# Altium project 28Pins_Project_V1I1.PrjPcb (part 4 of 5)
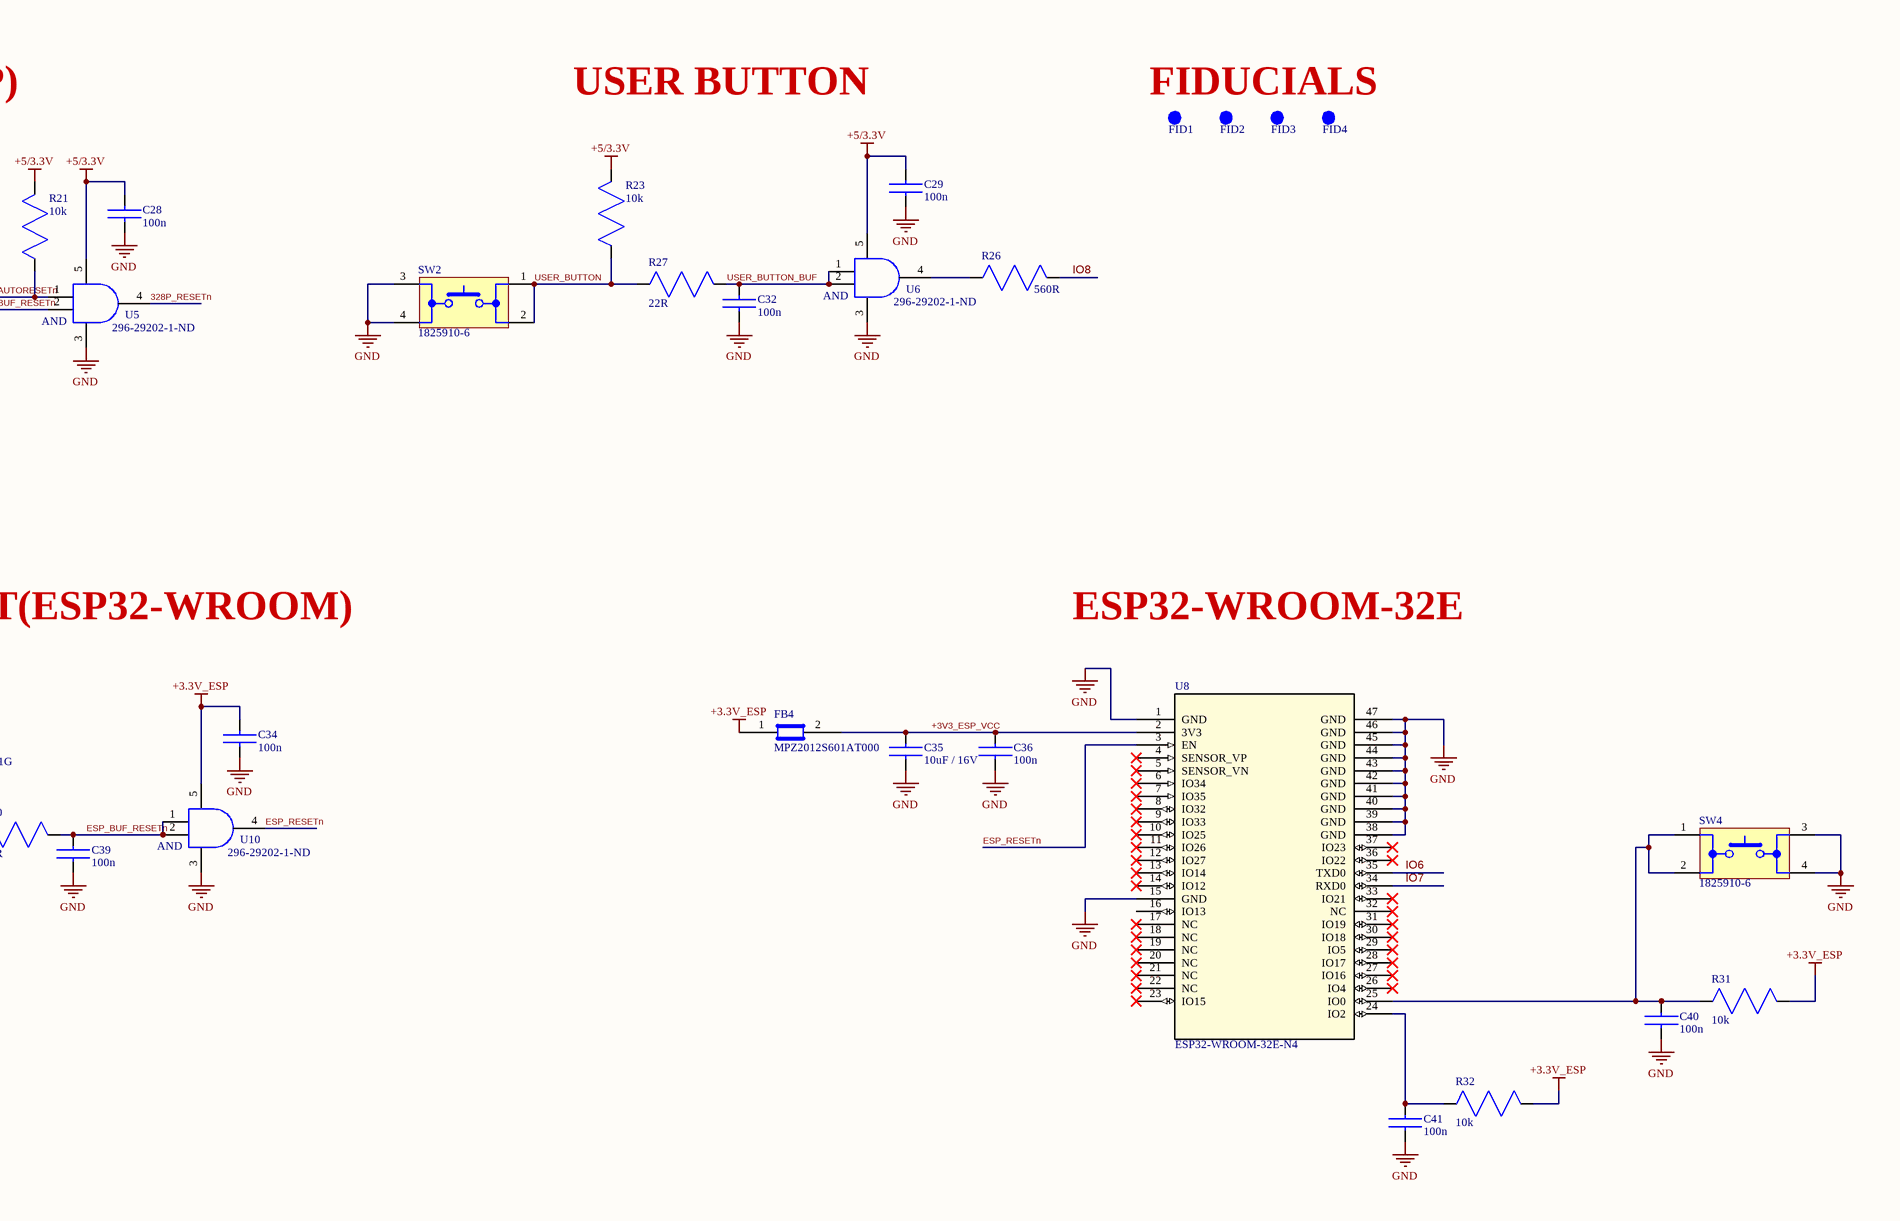
[diagram p6: 28Pins_Schematic.SchDoc, bottom right]

## Sheet 28Pins_Schematic.SchDoc (continued)

### Library data of the parts (continued)
R7 R19 R21-R24 R29 R31 R32 = RC0805FR-0710KL: Res Thick Film 0805 10K Ohm 1% 0.125W(1/8W) +/-100ppm/C Epoxy Pad SMD T/R; Manufacturer: Yageo Group; Max Power Dissipation: 125mW; Value: 10kΩ; Temperature Coefficient: 100ppm/°C; Voltage Rating: 150V; Supplier: DigiKey; Supplier Part Number: 311-10.0KCRCT-ND; Manufacturer Part Number: RC0805FR-0710KL; RoHS: Compliant; Category: Chip SMD Resistors; Pricing: 1=0.15, 10=0.016, 25=0.0136, 50=0.0112, 100=0.0071 (USD); Case/Package: 0805; Case Code (Imperial): 0805; China RoHS: Non-Compliant; Composition: Thick Film; Depth: 1.25mm; Features: Moisture Resistant; Height: 500µm; Lead Free: Lead Free; Length: 2mm; Lifecycle Status: Production; Max Operating Temperature: 155°C; Military Standard: Not; Min Operating Temperature: -55°C; Mounting Technology: Surface Mount; Pins: 2; Number of Terminals: 2; Number of Terminations: 2; Packaging: Tape and Reel; Power Dissipation: 125mW; Power Rating: 125mW; REACH SVHC: Yes; Schedule B: 8533210045, 8533210045|8533210045|8533210045|8533210045|8533210045|8533210045|8533210045|8533210045|8533210045|8533210045|8533210045|8533210045|8533210045|8533210045|8533210045|8533210045|8533210045|8533210045|8533210045|8533210045|8533210045|8533210045|8533210045|85; Termination: SMD/SMT; Tolerance: 1%; Voltage Rating (AC): 150V; Width: 1.25mm; Working Voltage: 150V; ComponentLink1URL: https://datasheet.octopart.com:443/RC0805FR-0710KL-Yageo-datasheet-175887523.pdf?src-supplier=IHS; ComponentLink1Description: https://datasheet.octopart.com:443/RC0805FR-0710KL-Yageo-datasheet-175887523.pdf?src-supplier=IHS; ComponentLink2URL: https://datasheet.octopart.com:443/RC0805FR-0710KL-Yageo-datasheet-62067350.pdf?src-supplier=Farnell; ComponentLink2Description: https://datasheet.octopart.com:443/RC0805FR-0710KL-Yageo-datasheet-62067350.pdf?src-supplier=Farnell; ComponentLink3URL: https://datasheet.octopart.com:443/RC0805FR-0710KL-Yageo-datasheet-13691069.pdf?src-supplier=Farnell; ComponentLink3Description: https://datasheet.octopart.com:443/RC0805FR-0710KL-Yageo-datasheet-13691069.pdf?src-supplier=Farnell; ComponentLink4URL: https://datasheet.octopart.com:443/RC0805FR-0710KL-Yageo-datasheet-103092701.pdf?src-supplier=Upverter; ComponentLink4Description: https://datasheet.octopart.com:443/RC0805FR-0710KL-Yageo-datasheet-103092701.pdf?src-supplier=Upverter; ComponentLink5URL: https://datasheet.octopart.com:443/RC0805FR-0710KL-Yageo-datasheet-98239111.pdf?src-supplier=Upverter; ComponentLink5Description: https://datasheet.octopart.com:443/RC0805FR-0710KL-Yageo-datasheet-98239111.pdf?src-supplier=Upverter; ComponentLink6URL: https://datasheet.octopart.com:443/RC0805FR-0710KL-Yageo---Phycomp-datasheet-67302840.pdf?src-supplier=Upverter; ComponentLink6Description: https://datasheet.octopart.com:443/RC0805FR-0710KL-Yageo---Phycomp-datasheet-67302840.pdf?src-supplier=Upverter; ComponentLink7URL: https://datasheet.octopart.com:443/RC0805FR-0710KL-Yageo-datasheet-8330313.pdf?src-supplier=element14+APAC; ComponentLink7Description: https://datasheet.octopart.com:443/RC0805FR-0710KL-Yageo-datasheet-8330313.pdf?src-supplier=element14+APAC; ComponentLink8URL: https://datasheet.octopart.com:443/RC0805FR-0710KL-Yageo-datasheet-12592811.pdf?src-supplier=element14+APAC; ComponentLink8Description: https://datasheet.octopart.com:443/RC0805FR-0710KL-Yageo-datasheet-12592811.pdf?src-supplier=element14+APAC; ComponentLink9URL: https://datasheet.octopart.com:443/RC0805FR-0710KL-Yageo-datasheet-164759695.pdf?src-supplier=Future+Electronics; ComponentLink9Description: https://datasheet.octopart.com:443/RC0805FR-0710KL-Yageo-datasheet-164759695.pdf?src-supplier=Future+Electronics; ComponentLink10URL: https://datasheet.octopart.com:443/RC0805FR-0710KL-Yageo-datasheet-15800360.pdf?src-supplier=Future+Electronics; ComponentLink10Description: https://datasheet.octopart.com:443/RC0805FR-0710KL-Yageo-datasheet-15800360.pdf?src-supplier=Future+Electronics; ComponentLink11URL: https://datasheet.octopart.com:443/RC0805FR-0710KL-Yageo-datasheet-8324252.pdf?src-supplier=Future+Electronics; ComponentLink11Description: https://datasheet.octopart.com:443/RC0805FR-0710KL-Yageo-datasheet-8324252.pdf?src-supplier=Future+Electronics; ComponentLink12URL: https://datasheet.octopart.com:443/RC0805FR-0710KL-Yageo-datasheet-79472498.pdf?src-supplier=Megastar; ComponentLink12Description: https://datasheet.octopart.com:443/RC0805FR-0710KL-Yageo-datasheet-79472498.pdf?src-supplier=Megastar; ComponentLink13URL: https://datasheet.octopart.com:443/RC0805FR-0710KL-Yageo-datasheet-27714392.pdf?src-supplier=Seeed+Studio; ComponentLink13Description: https://datasheet.octopart.com:443/RC0805FR-0710KL-Yageo-datasheet-27714392.pdf?src-supplier=Seeed+Studio; ComponentLink14URL: https://datasheet.octopart.com/RC0805FR-0710KL-Yageo-datasheet-73766026.pdf; ComponentLink14Description: https://datasheet.octopart.com/RC0805FR-0710KL-Yageo-datasheet-73766026.pdf; ComponentLink15URL: https://datasheet.octopart.com:443/RC0805FR-0710KL-Yageo-datasheet-118657.pdf?src-supplier=DigiKey; ComponentLink15Description: https://datasheet.octopart.com:443/RC0805FR-0710KL-Yageo-datasheet-118657.pdf?src-supplier=DigiKey; ComponentLink16URL: https://datasheet.octopart.com:443/RC0805FR-0710KL-Yageo-datasheet-502840.pdf?src-supplier=element14; ComponentLink16Description: https://datasheet.octopart.com:443/RC0805FR-0710KL-Yageo-datasheet-502840.pdf?src-supplier=element14; ComponentLink17URL: http://sigma.octopart.com:80/rohs_statement/Yageo-company-2.pdf?src-supplier=Compliance+Statements; ComponentLink17Description: http://sigma.octopart.com:80/rohs_statement/Yageo-company-2.pdf?src-supplier=Compliance+Statements; ComponentLink18URL: http://sigma.octopart.com:80/conflict_mineral_statement/Yageo-company-3.pdf?src-supplier=Compliance+Statements; ComponentLink18Description: http://sigma.octopart.com:80/conflict_mineral_statement/Yageo-company-3.pdf?src-supplier=Compliance+Statements
R8-R10 R18 R25 R27 R28 R30 = RC0805FR-072R2L: 125mW Thick Film Resistors 150V ±1% ±200ppm/℃ 2.2Ω 0805 Chip Resistor - Surface Mount ROHS; Manufacturer: Yageo Group; Temperature Coefficient: 200ppm/°C; Supplier: DigiKey; Supplier Part Number: 311-2.20CRCT-ND; Manufacturer Part Number: RC0805FR-072R2L; RoHS: Compliant; Category: Chip SMD Resistors; Stock: 48427; Pricing: 1=0.1, 10=0.022, 25=0.022, 50=0.0142 (USD); Case/Package: 0805; Case Code (Imperial): 0805; China RoHS: Non-Compliant; Composition: Thick Film; Depth: 1.25mm; Height: 500µm; Lead Free: Lead Free; Length: 2mm; Lifecycle Status: Production; Max Operating Temperature: 155°C; Military Standard: Not; Min Operating Temperature: -55°C; Mounting Technology: Surface Mount; Pins: 2; Number of Terminals: 2; Packaging: Cut Tape; Power Dissipation: 125mW; Power Rating: 125mW; REACH SVHC: Yes; Value: 2.2Ω; Schedule B: 8533210045, 8533210045|8533210045|8533210045|8533210045|8533210045|8533210045|8533210045|8533210045|8533210045|8533210045|8533210045|8533210045|8533210045|8533210045, 8533210045|8533210045|8533210045|8533210045|8533210045|8533210045|8533210045|8533210045|8533210045|8533210045|8533210045|8533210045|8533210045|8533210045|8533210045, 8533210045|8533210045|8533210045|8533210045|8533210045|8533210045|8533210045|8533210045|8533210045|8533210045|8533210045|8533210045|8533210045|8533210045|8533210045|8533210045; Termination: SMD/SMT; Tolerance: 1%; Voltage Rating: 150V; Voltage Rating (AC): 150V; Voltage Rating (DC): 150V; Width: 1.25mm; Working Voltage: 150V; ComponentLink1URL: https://datasheet.octopart.com:443/RC0805FR-072R2L-Yageo-datasheet-175887523.pdf?src-supplier=Newark; ComponentLink1Description: https://datasheet.octopart.com:443/RC0805FR-072R2L-Yageo-datasheet-175887523.pdf?src-supplier=Newark; ComponentLink2URL: https://datasheet.octopart.com:443/RC0805FR-072R2L-Yageo-datasheet-103092701.pdf?src-supplier=Upverter; ComponentLink2Description: https://datasheet.octopart.com:443/RC0805FR-072R2L-Yageo-datasheet-103092701.pdf?src-supplier=Upverter; ComponentLink3URL: https://datasheet.octopart.com:443/RC0805FR-072R2L-Yageo-datasheet-8330313.pdf?src-supplier=element14+APAC; ComponentLink3Description: https://datasheet.octopart.com:443/RC0805FR-072R2L-Yageo-datasheet-8330313.pdf?src-supplier=element14+APAC; ComponentLink4URL: https://datasheet.octopart.com:443/RC0805FR-072R2L-Yageo-datasheet-62067350.pdf?src-supplier=element14+APAC; ComponentLink4Description: https://datasheet.octopart.com:443/RC0805FR-072R2L-Yageo-datasheet-62067350.pdf?src-supplier=element14+APAC; ComponentLink5URL: https://datasheet.octopart.com:443/RC0805FR-072R2L-Yageo-datasheet-164759695.pdf?src-supplier=Future+Electronics; ComponentLink5Description: https://datasheet.octopart.com:443/RC0805FR-072R2L-Yageo-datasheet-164759695.pdf?src-supplier=Future+Electronics; ComponentLink6URL: https://datasheet.octopart.com:443/RC0805FR-072R2L-Yageo-datasheet-127823281.pdf?src-supplier=Future+Electronics; ComponentLink6Description: https://datasheet.octopart.com:443/RC0805FR-072R2L-Yageo-datasheet-127823281.pdf?src-supplier=Future+Electronics; ComponentLink7URL: https://datasheet.octopart.com:443/RC0805FR-072R2L-Yageo-datasheet-137700087.pdf?src-supplier=Future+Electronics; ComponentLink7Description: https://datasheet.octopart.com:443/RC0805FR-072R2L-Yageo-datasheet-137700087.pdf?src-supplier=Future+Electronics; ComponentLink8URL: https://datasheet.octopart.com:443/RC0805FR-072R2L-Yageo-datasheet-12592811.pdf?src-supplier=Future+Electronics; ComponentLink8Description: https://datasheet.octopart.com:443/RC0805FR-072R2L-Yageo-datasheet-12592811.pdf?src-supplier=Future+Electronics; ComponentLink9URL: https://datasheet.octopart.com:443/RC0805FR-072R2L-Yageo-datasheet-8324252.pdf?src-supplier=Future+Electronics; ComponentLink9Description: https://datasheet.octopart.com:443/RC0805FR-072R2L-Yageo-datasheet-8324252.pdf?src-supplier=Future+Electronics; ComponentLink10URL: https://datasheet.octopart.com:443/RC0805FR-072R2L-Yageo-datasheet-148775077.pdf?src-supplier=TME; ComponentLink10Description: https://datasheet.octopart.com:443/RC0805FR-072R2L-Yageo-datasheet-148775077.pdf?src-supplier=TME; ComponentLink11URL: https://datasheet.octopart.com/RC0805FR-072R2L-Yageo-datasheet-73766026.pdf; ComponentLink11Description: https://datasheet.octopart.com/RC0805FR-072R2L-Yageo-datasheet-73766026.pdf; ComponentLink12URL: https://datasheet.octopart.com:443/RC0805FR-072R2L-Yageo-datasheet-13691069.pdf?src-supplier=Farnell; ComponentLink12Description: https://datasheet.octopart.com:443/RC0805FR-072R2L-Yageo-datasheet-13691069.pdf?src-supplier=Farnell; ComponentLink13URL: https://datasheet.octopart.com:443/RC0805FR-072R2L-Yageo-datasheet-118657.pdf?src-supplier=DigiKey; ComponentLink13Description: https://datasheet.octopart.com:443/RC0805FR-072R2L-Yageo-datasheet-118657.pdf?src-supplier=DigiKey; ComponentLink14URL: http://sigma.octopart.com:80/rohs_statement/Yageo-company-2.pdf?src-supplier=Compliance+Statements; ComponentLink14Description: http://sigma.octopart.com:80/rohs_statement/Yageo-company-2.pdf?src-supplier=Compliance+Statements; ComponentLink15URL: http://sigma.octopart.com:80/conflict_mineral_statement/Yageo-company-3.pdf?src-supplier=Compliance+Statements; ComponentLink15Description: http://sigma.octopart.com:80/conflict_mineral_statement/Yageo-company-3.pdf?src-supplier=Compliance+Statements
R12 R14 R17 = RC0805FR-071KL: Resistor, thick film, SMD 0805 (2012), 1 kΩ, 0.125 W, ±1 %, RC0805FR-071KL; Manufacturer: Yageo Group; Max Power Dissipation: 125mW; Value: 1kΩ; Temperature Coefficient: 100ppm/°C; Tolerance: 1%; Voltage Rating: 150V; Supplier: DigiKey; Supplier Part Number: 311-1.00KCRDKR-ND; Manufacturer Part Number: RC0805FR-071KL; RoHS: Compliant; Category: Chip SMD Resistors; Pricing: 1=0.12, 10=0.013, 25=0.0124, 50=0.0072 (USD); Case/Package: 0805; Case Code (Imperial): 0805; China RoHS: Non-Compliant; Composition: Thick Film; Depth: 1.25mm; Features: Moisture Resistant; Height: 500µm; Lead Free: Lead Free; Length: 2mm; Lifecycle Status: Production; Max Operating Temperature: 155°C; Military Standard: Not; Min Operating Temperature: -55°C; Mounting Technology: Surface Mount; Pins: 2; Number of Terminals: 2; Number of Terminations: 2; Packaging: Tape & Reel; Power Dissipation: 125mW; Power Rating: 125mW; REACH SVHC: Yes; Schedule B: 8533210045, 8533210045|8533210045, 8533210045|8533210045|8533210045, 8533210045|8533210045|8533210045|8533210045; Termination: SMD/SMT; Voltage Rating (AC): 150V; Voltage Rating (DC): 150V; Width: 1.25mm; Working Voltage: 150V; ComponentLink1URL: https://datasheet.octopart.com:443/RC0805FR-071KL-Yageo-datasheet-175887523.pdf?src-supplier=IHS; ComponentLink1Description: https://datasheet.octopart.com:443/RC0805FR-071KL-Yageo-datasheet-175887523.pdf?src-supplier=IHS; ComponentLink2URL: https://datasheet.octopart.com:443/RC0805FR-071KL-Yageo-datasheet-103092701.pdf?src-supplier=Upverter; ComponentLink2Description: https://datasheet.octopart.com:443/RC0805FR-071KL-Yageo-datasheet-103092701.pdf?src-supplier=Upverter; ComponentLink3URL: https://datasheet.octopart.com:443/RC0805FR-071KL-Yageo-datasheet-8330313.pdf?src-supplier=element14+APAC; ComponentLink3Description: https://datasheet.octopart.com:443/RC0805FR-071KL-Yageo-datasheet-8330313.pdf?src-supplier=element14+APAC; ComponentLink4URL: https://datasheet.octopart.com:443/RC0805FR-071KL-Yageo-datasheet-62067350.pdf?src-supplier=element14+APAC; ComponentLink4Description: https://datasheet.octopart.com:443/RC0805FR-071KL-Yageo-datasheet-62067350.pdf?src-supplier=element14+APAC; ComponentLink5URL: https://datasheet.octopart.com:443/RC0805FR-071KL-Yageo-datasheet-12592811.pdf?src-supplier=element14+APAC; ComponentLink5Description: https://datasheet.octopart.com:443/RC0805FR-071KL-Yageo-datasheet-12592811.pdf?src-supplier=element14+APAC; ComponentLink6URL: https://datasheet.octopart.com:443/RC0805FR-071KL-Yageo-datasheet-164759695.pdf?src-supplier=Future+Electronics; ComponentLink6Description: https://datasheet.octopart.com:443/RC0805FR-071KL-Yageo-datasheet-164759695.pdf?src-supplier=Future+Electronics; ComponentLink7URL: https://datasheet.octopart.com:443/RC0805FR-071KL-Yageo-datasheet-8324252.pdf?src-supplier=Future+Electronics; ComponentLink7Description: https://datasheet.octopart.com:443/RC0805FR-071KL-Yageo-datasheet-8324252.pdf?src-supplier=Future+Electronics; ComponentLink8URL: https://datasheet.octopart.com:443/RC0805FR-071KL-Yageo-datasheet-79472498.pdf?src-supplier=Megastar; ComponentLink8Description: https://datasheet.octopart.com:443/RC0805FR-071KL-Yageo-datasheet-79472498.pdf?src-supplier=Megastar; ComponentLink9URL: https://datasheet.octopart.com/RC0805FR-071KL-Yageo-datasheet-73766026.pdf; ComponentLink9Description: https://datasheet.octopart.com/RC0805FR-071KL-Yageo-datasheet-73766026.pdf; ComponentLink10URL: https://datasheet.octopart.com:443/RC0805FR-071KL-Yageo-datasheet-13691069.pdf?src-supplier=Farnell; ComponentLink10Description: https://datasheet.octopart.com:443/RC0805FR-071KL-Yageo-datasheet-13691069.pdf?src-supplier=Farnell; ComponentLink11URL: https://datasheet.octopart.com:443/RC0805FR-071KL-Yageo-datasheet-118657.pdf?src-supplier=DigiKey; ComponentLink11Description: https://datasheet.octopart.com:443/RC0805FR-071KL-Yageo-datasheet-118657.pdf?src-supplier=DigiKey; ComponentLink12URL: https://datasheet.octopart.com:443/RC0805FR-071KL-Yageo-datasheet-502840.pdf?src-supplier=element14; ComponentLink12Description: https://datasheet.octopart.com:443/RC0805FR-071KL-Yageo-datasheet-502840.pdf?src-supplier=element14; ComponentLink13URL: http://sigma.octopart.com:80/rohs_statement/Yageo-company-2.pdf?src-supplier=Compliance+Statements; ComponentLink13Description: http://sigma.octopart.com:80/rohs_statement/Yageo-company-2.pdf?src-supplier=Compliance+Statements; ComponentLink14URL: http://sigma.octopart.com:80/conflict_mineral_statement/Yageo-company-3.pdf?src-supplier=Compliance+Statements; ComponentLink14Description: http://sigma.octopart.com:80/conflict_mineral_statement/Yageo-company-3.pdf?src-supplier=Compliance+Statements
R13 R20 = RC0805FR-071ML: 125mW Thick Film Resistors 150V ±100ppm/℃ ±1% 1MΩ 0805 Chip Resistor - Surface Mount ROHS; Manufacturer: Yageo Group; Temperature Coefficient: 100ppm/°C; Supplier: DigiKey; Supplier Part Number: 311-1.00MCRDKR-ND; Manufacturer Part Number: RC0805FR-071ML; RoHS: Compliant; Category: Chip SMD Resistors; Pricing: 1=0.1, 10=0.014, 25=0.0132, 50=0.0122, 100=0.0071 (USD); Case/Package: 0805; Case Code (Imperial): 0805; China RoHS: Non-Compliant; Composition: Thick Film; Depth: 1.25mm; Features: Moisture Resistant; Height: 500µm; Lead Free: Lead Free; Length: 2mm; Lifecycle Status: Production; Max Operating Temperature: 155°C; Max Power Dissipation: 125mW; Military Standard: Not; Min Operating Temperature: -55°C; Mounting Technology: Surface Mount; Pins: 2; Number of Terminals: 2; Number of Terminations: 2; Packaging: Tape & Reel; Power Dissipation: 125mW; Power Rating: 125mW; REACH SVHC: Yes; Value: 1MΩ; Schedule B: 8533210045, 8533210045|8533210045, 8533210045|8533210045|8533210045, 8533210045|8533210045|8533210045|8533210045; Termination: SMD/SMT; Tolerance: 1%; Voltage Rating: 150V; Voltage Rating (AC): 150V; Voltage Rating (DC): 150V; Width: 1.25mm; Working Voltage: 150V; ComponentLink1URL: https://datasheet.octopart.com:443/RC0805FR-071ML-Yageo-datasheet-175887523.pdf?src-supplier=IHS; ComponentLink1Description: https://datasheet.octopart.com:443/RC0805FR-071ML-Yageo-datasheet-175887523.pdf?src-supplier=IHS; ComponentLink2URL: https://datasheet.octopart.com:443/RC0805FR-071ML-Yageo-datasheet-103092701.pdf?src-supplier=Upverter; ComponentLink2Description: https://datasheet.octopart.com:443/RC0805FR-071ML-Yageo-datasheet-103092701.pdf?src-supplier=Upverter; ComponentLink3URL: https://datasheet.octopart.com:443/RC0805FR-071ML-Yageo-datasheet-79472498.pdf?src-supplier=Upverter; ComponentLink3Description: https://datasheet.octopart.com:443/RC0805FR-071ML-Yageo-datasheet-79472498.pdf?src-supplier=Upverter; ComponentLink4URL: https://datasheet.octopart.com:443/RC0805FR-071ML-Yageo-datasheet-8330313.pdf?src-supplier=element14+APAC; ComponentLink4Description: https://datasheet.octopart.com:443/RC0805FR-071ML-Yageo-datasheet-8330313.pdf?src-supplier=element14+APAC; ComponentLink5URL: https://datasheet.octopart.com:443/RC0805FR-071ML-Yageo-datasheet-62067350.pdf?src-supplier=Farnell; ComponentLink5Description: https://datasheet.octopart.com:443/RC0805FR-071ML-Yageo-datasheet-62067350.pdf?src-supplier=Farnell; ComponentLink6URL: https://datasheet.octopart.com:443/RC0805FR-071ML-Yageo-datasheet-13691069.pdf?src-supplier=Farnell; ComponentLink6Description: https://datasheet.octopart.com:443/RC0805FR-071ML-Yageo-datasheet-13691069.pdf?src-supplier=Farnell; ComponentLink7URL: https://datasheet.octopart.com:443/RC0805FR-071ML-Yageo-datasheet-164759695.pdf?src-supplier=Future+Electronics; ComponentLink7Description: https://datasheet.octopart.com:443/RC0805FR-071ML-Yageo-datasheet-164759695.pdf?src-supplier=Future+Electronics; ComponentLink8URL: https://datasheet.octopart.com:443/RC0805FR-071ML-Yageo-datasheet-127823281.pdf?src-supplier=Future+Electronics; ComponentLink8Description: https://datasheet.octopart.com:443/RC0805FR-071ML-Yageo-datasheet-127823281.pdf?src-supplier=Future+Electronics; ComponentLink9URL: https://datasheet.octopart.com:443/RC0805FR-071ML-Yageo-datasheet-137700087.pdf?src-supplier=Future+Electronics; ComponentLink9Description: https://datasheet.octopart.com:443/RC0805FR-071ML-Yageo-datasheet-137700087.pdf?src-supplier=Future+Electronics; ComponentLink10URL: https://datasheet.octopart.com:443/RC0805FR-071ML-Yageo-datasheet-12592811.pdf?src-supplier=Future+Electronics; ComponentLink10Description: https://datasheet.octopart.com:443/RC0805FR-071ML-Yageo-datasheet-12592811.pdf?src-supplier=Future+Electronics; ComponentLink11URL: https://datasheet.octopart.com:443/RC0805FR-071ML-Yageo-datasheet-8324252.pdf?src-supplier=Future+Electronics; ComponentLink11Description: https://datasheet.octopart.com:443/RC0805FR-071ML-Yageo-datasheet-8324252.pdf?src-supplier=Future+Electronics; ComponentLink12URL: https://datasheet.octopart.com/RC0805FR-071ML-Yageo-datasheet-73766026.pdf; ComponentLink12Description: https://datasheet.octopart.com/RC0805FR-071ML-Yageo-datasheet-73766026.pdf; ComponentLink13URL: https://datasheet.octopart.com:443/RC0805FR-071ML-Yageo-datasheet-118657.pdf?src-supplier=DigiKey; ComponentLink13Description: https://datasheet.octopart.com:443/RC0805FR-071ML-Yageo-datasheet-118657.pdf?src-supplier=DigiKey; ComponentLink14URL: https://datasheet.octopart.com:443/RC0805FR-071ML-Yageo-datasheet-502840.pdf?src-supplier=element14; ComponentLink14Description: https://datasheet.octopart.com:443/RC0805FR-071ML-Yageo-datasheet-502840.pdf?src-supplier=element14; ComponentLink15URL: http://sigma.octopart.com:80/rohs_statement/Yageo-company-2.pdf?src-supplier=Compliance+Statements; ComponentLink15Description: http://sigma.octopart.com:80/rohs_statement/Yageo-company-2.pdf?src-supplier=Compliance+Statements; ComponentLink16URL: http://sigma.octopart.com:80/conflict_mineral_statement/Yageo-company-3.pdf?src-supplier=Compliance+Statements; ComponentLink16Description: http://sigma.octopart.com:80/conflict_mineral_statement/Yageo-company-3.pdf?src-supplier=Compliance+Statements
SCKT_FOR_U1 = 4828-3004-CP: IC Socket, DIP28, 28 Contact(s), 2.54mm Term Pitch, 7.62mm Row Spacing, Solder; Manufacturer: 3M; Connector Type: DIP, Socket; Current Rating: 1A; Gender: Female; Insulation Resistance: 5GΩ; Number of Contacts: 28; Supplier: DigiKey; Supplier Part Number: 3M5480-ND; Manufacturer Part Number: 4828-3004-CP; RoHS: Compliant; Category: Connectors; Stock: 5452; Pricing: 1=0.96, 14=0.79786, 28=0.75929, 56=0.72304, 112=0.68848, 252=0.65016, 504=0.61911, 1008=0.58954, 2506=0.55285 (USD); China RoHS: Compliant; Contact Material: Bronze; Contact Plating: Tin; Depth: 5.08mm; Housing Material: Glass; Lead Free: Lead Free; Length: 35.43mm; Lifecycle Status: Production; Max Operating Temperature: 85°C; Min Operating Temperature: -25°C; Mounting Technology: Through Hole; Pins: 28; Number of Positions: 28; Number of Rows: 2; Orientation: Straight; Pitch: 2.54mm; REACH SVHC: Yes; Row Spacing: 7.62mm; Terminal Pitch: 2.54mm; Termination: Solder; Width: 10.16mm; ComponentLink1URL: https://datasheet.octopart.com:443/4828-3004-CP-3M-datasheet-11754339.pdf?src-supplier=element14+APAC; ComponentLink1Description: https://datasheet.octopart.com:443/4828-3004-CP-3M-datasheet-11754339.pdf?src-supplier=element14+APAC; ComponentLink2URL: https://datasheet.octopart.com:443/4828-3004-CP-3M-datasheet-125432.pdf?src-supplier=Verical; ComponentLink2Description: https://datasheet.octopart.com:443/4828-3004-CP-3M-datasheet-125432.pdf?src-supplier=Verical; ComponentLink3URL: https://datasheet.octopart.com:443/4828-3004-CP-3M-datasheet-110561487.pdf?src-supplier=RS+(Formerly+Allied+Electronics); ComponentLink3Description: https://datasheet.octopart.com:443/4828-3004-CP-3M-datasheet-110561487.pdf?src-supplier=RS+(Formerly+Allied+Electronics); ComponentLink4URL: https://datasheet.octopart.com:443/4828-3004-CP-3M-datasheet-12002015.pdf?src-supplier=RS+(Formerly+Allied+Electronics); ComponentLink4Description: https://datasheet.octopart.com:443/4828-3004-CP-3M-datasheet-12002015.pdf?src-supplier=RS+(Formerly+Allied+Electronics); ComponentLink5URL: http://sigma.octopart.com:80/conflict_mineral_statement/3M-company-24.pdf?src-supplier=Compliance+Statements; ComponentLink5Description: http://sigma.octopart.com:80/conflict_mineral_statement/3M-company-24.pdf?src-supplier=Compliance+Statements
SW1-SW4 = 1825910-6: Switch Tactile OFF (ON) SPST Round Button PC Pins 0.05A 24VDC 1.57N Thru-Hole Loose; Manufacturer: TE Connectivity; Manufacturer Lifecycle Status: ACTIVE; Actuator Length: 1.397mm; Actuator Material: PBT, Polyacetal, Resin; Contact Current Rating: 50mA; Contact Resistance: 100mΩ; Electrical Life: 100kcycles; Illumination Type: Illuminated, Non-Illuminated; Max Voltage Rating (DC): 24V; Number of Positions: 1; Operating Force: 1.568N; Switch Function: Off-Mom; Switch Travel: 250µm; Supplier: DigiKey; Supplier Part Number: 450-1650-ND; Manufacturer Part Number: 1825910-6; RoHS: Compliant; Category: Pushbutton Switches; Stock: 50938; Pricing: 1=0.13, 10=0.118, 25=0.1112, 100=0.1001, 250=0.093, 750=0.08485, 1500=0.08009, 3000=0.07565, 5250=0.07234 (USD); China RoHS: Compliant; Color: Black; Contact Material: Copper; Contact Plating: Silver; Current Rating: 50mA; ELV: Compliant; Height: 3.61mm; Housing Material: Nylon; Insulation Resistance: 100MΩ; Lead Free: Lead Free; Length: 5.99mm; Life (Cycles): 100kcycles; Lifecycle Status: Production; Material: Nylon; Max Current Rating: 50mA; Max Operating Temperature: 85°C; Mechanical Life: 100kcycles; Min Operating Temperature: -35°C; Mounting Technology: Through Hole; Orientation: Straight; Packaging: Bulk; REACH SVHC: Yes; Termination: PC Pin, PC Pins; Throw Configuration: SPST; Type: Switch; Voltage Rating (DC): 24V; Width: 6mm; ComponentLink1URL: https://datasheet.octopart.com:443/1825910-6-TE-Connectivity-datasheet-10294628.pdf?src-supplier=Newark; ComponentLink1Description: https://datasheet.octopart.com:443/1825910-6-TE-Connectivity-datasheet-10294628.pdf?src-supplier=Newark; ComponentLink2URL: https://datasheet.octopart.com:443/1825910-6-TE-Connectivity-datasheet-179971975.pdf?src-supplier=IHS; ComponentLink2Description: https://datasheet.octopart.com:443/1825910-6-TE-Connectivity-datasheet-179971975.pdf?src-supplier=IHS; ComponentLink3URL: https://datasheet.octopart.com:443/FSM4JH-TE-Connectivity---AMP-datasheet-512274.pdf?src-supplier=IHS; ComponentLink3Description: https://datasheet.octopart.com:443/FSM4JH-TE-Connectivity---AMP-datasheet-512274.pdf?src-supplier=IHS; ComponentLink4URL: https://datasheet.octopart.com:443/1825910-6-TE-Connectivity---Alcoswitch-datasheet-181441334.pdf?src-supplier=IHS; ComponentLink4Description: https://datasheet.octopart.com:443/1825910-6-TE-Connectivity---Alcoswitch-datasheet-181441334.pdf?src-supplier=IHS; ComponentLink5URL: https://datasheet.octopart.com:443/FSM4JH-TE-Connectivity-datasheet-181317608.pdf?src-supplier=IHS; ComponentLink5Description: https://datasheet.octopart.com:443/FSM4JH-TE-Connectivity-datasheet-181317608.pdf?src-supplier=IHS; ComponentLink6URL: https://sigma.octopart.com:443/101748000/technical_drawing/TE-Connectivity-1825910-6.pdf?src-supplier=Sager+Electronics; ComponentLink6Description: https://sigma.octopart.com:443/101748000/technical_drawing/TE-Connectivity-1825910-6.pdf?src-supplier=Sager+Electronics; ComponentLink7URL: https://sigma.octopart.com:443/12291753/technical_drawing/TE-Connectivity-1825910-6.pdf?src-supplier=Burklin+Elektronik; ComponentLink7Description: https://sigma.octopart.com:443/12291753/technical_drawing/TE-Connectivity-1825910-6.pdf?src-supplier=Burklin+Elektronik; ComponentLink8URL: https://datasheet.octopart.com:443/FSM4JH-Tyco-Electronics-datasheet-5302851.pdf?src-supplier=Upverter; ComponentLink8Description: https://datasheet.octopart.com:443/FSM4JH-Tyco-Electronics-datasheet-5302851.pdf?src-supplier=Upverter; ComponentLink9URL: https://sigma.octopart.com:443/58177301/technical_drawing/TE-Connectivity-1825910-6.pdf?src-supplier=TE+Connectivity; ComponentLink9Description: https://sigma.octopart.com:443/58177301/technical_drawing/TE-Connectivity-1825910-6.pdf?src-supplier=TE+Connectivity; ComponentLink10URL: https://datasheet.octopart.com:443/1825910-6-TE-Connectivity-datasheet-33021037.pdf?src-supplier=Farnell; ComponentLink10Description: https://datasheet.octopart.com:443/1825910-6-TE-Connectivity-datasheet-33021037.pdf?src-supplier=Farnell; ComponentLink11URL: https://datasheet.octopart.com:443/FSM4JH-Tyco-Electronics-datasheet-12163206.pdf?src-supplier=Farnell; ComponentLink11Description: https://datasheet.octopart.com:443/FSM4JH-Tyco-Electronics-datasheet-12163206.pdf?src-supplier=Farnell; ComponentLink12URL: https://datasheet.octopart.com:443/FSM4JH-Alcoswitch-datasheet-41434433.pdf?src-supplier=Master+Electronics; ComponentLink12Description: https://datasheet.octopart.com:443/FSM4JH-Alcoswitch-datasheet-41434433.pdf?src-supplier=Master+Electronics; ComponentLink13URL: https://datasheet.octopart.com:443/1825910-6-TE-Connectivity---AMP-datasheet-189108451.pdf?src-supplier=Master+Electronics; ComponentLink13Description: https://datasheet.octopart.com:443/1825910-6-TE-Connectivity---AMP-datasheet-189108451.pdf?src-supplier=Master+Electronics; ComponentLink14URL: https://datasheet.octopart.com:443/1825910-6-TE-Connectivity-datasheet-145419878.pdf?src-supplier=RS+(Formerly+Allied+Electronics); ComponentLink14Description: https://datasheet.octopart.com:443/1825910-6-TE-Connectivity-datasheet-145419878.pdf?src-supplier=RS+(Formerly+Allied+Electronics); ComponentLink15URL: https://datasheet.octopart.com:443/FSM4JH-Agastat-datasheet-15984561.pdf?src-supplier=RS+(Formerly+Allied+Electronics); ComponentLink15Description: https://datasheet.octopart.com:443/FSM4JH-Agastat-datasheet-15984561.pdf?src-supplier=RS+(Formerly+Allied+Electronics); ComponentLink16URL: https://datasheet.octopart.com:443/1825910-6-TE-Connectivity-datasheet-140613545.pdf?src-supplier=TME; ComponentLink16Description: https://datasheet.octopart.com:443/1825910-6-TE-Connectivity-datasheet-140613545.pdf?src-supplier=TME; ComponentLink17URL: https://datasheet.octopart.com:443/1825910-6-TE-Connectivity---AMP-datasheet-23715110.pdf?src-supplier=Electro+Sonic; ComponentLink17Description: https://datasheet.octopart.com:443/1825910-6-TE-Connectivity---AMP-datasheet-23715110.pdf?src-supplier=Electro+Sonic; ComponentLink18URL: http://sigma.octopart.com:80/14574207/rohs_statement/TE-Connectivity-1825910-6.pdf?src-supplier=Compliance+Statements; ComponentLink18Description: http://sigma.octopart.com:80/14574207/rohs_statement/TE-Connectivity-1825910-6.pdf?src-supplier=Compliance+Statements; ComponentLink19URL: http://sigma.octopart.com:80/41598133/materials_sheet/TE-Connectivity-1825910-6.pdf?src-supplier=Compliance+Statements; ComponentLink19Description: http://sigma.octopart.com:80/41598133/materials_sheet/TE-Connectivity-1825910-6.pdf?src-supplier=Compliance+Statements; ComponentLink20URL: http://sigma.octopart.com:80/78006367/materials_sheet/TE-Connectivity-1825910-6.pdf?src-supplier=Compliance+Statements; ComponentLink20Description: http://sigma.octopart.com:80/78006367/materials_sheet/TE-Connectivity-1825910-6.pdf?src-supplier=Compliance+Statements; ComponentLink21URL: http://sigma.octopart.com:80/136693561/materials_sheet/TE-Connectivity-1825910-6.pdf?src-supplier=Compliance+Statements; ComponentLink21Description: http://sigma.octopart.com:80/136693561/materials_sheet/TE-Connectivity-1825910-6.pdf?src-supplier=Compliance+Statements; ComponentLink22URL: http://sigma.octopart.com:80/14555950/rohs_certificate/Agastat-FSM4JH.pdf?src-supplier=Compliance+Statements; ComponentLink22Description: http://sigma.octopart.com:80/14555950/rohs_certificate/Agastat-FSM4JH.pdf?src-supplier=Compliance+Statements
U1 = ATMEGA16U2-AU: Risc Microcontroller, 8-BIT, Flash, AVR Risc Cpu, 16MHZ, Cmos, PQFP32; Manufacturer: Microchip; Data Bus Width: 8b; Interface: SPI, Serial, UART, USART, USB; Max Supply Voltage: 5.5V; Memory Size: 16kB; Min Supply Voltage: 2.7V; Number of I/Os: 22; Number of PWM Channels: 5; Number of SPI Channels: 1; Number of Timers/Counters: 2; Oscillator Type: Internal; Peripherals: Brown-out Detect/Reset, POR, PWM, WDT; RAM Size: 512B; Watchdog Timer: Yes; Supplier: DigiKey; Supplier Part Number: ATMEGA16U2-AU-ND; Manufacturer Part Number: ATMEGA16U2-AU; RoHS: Compliant; Category: Microcontrollers; Stock: 27380; Pricing: 1=3.24, 25=2.97, 100=2.7 (USD); Projected EOL Date: 2039-11-08; Case/Package: TQFP; Contact Plating: Tin; Core Architecture: AVR; Country of Assembly: Philippines; Country of Fabrication: United States of America; Country of Origin: Philippines; Export Control Classification Number (ECCN) Code: EAR99; Frequency: 16MHz; Height: 1.05mm; Harmonized Tariff Schedule (HTS) Code: 8542.31.0015; Lead Free: Lead Free; Length: 7mm; Lifecycle Status: Production; Clock Frequency: 16MHz; Max Operating Temperature: 85°C; Memory Format: FLASH; Min Operating Temperature: -40°C; Mounting Technology: Surface Mount; Pins: 32; Number of Programmable I/O: 22; REACH SVHC: No; Schedule B: 8542310000, 8542310000|8542310000|8542310000|8542310000|8542310000|8542310000|8542310000|8542310000|8542310000|8542310000|8542310000|8542310000|8542310000|8542310000|8542310000|8542310000|8542310000|8542310000|8542310000|8542310000|8542310000|8542310000|8542310000|85; Width: 7mm; ComponentLink1URL: https://datasheet.octopart.com:443/ATMEGA16U2-AU-Microchip-datasheet-14435305.pdf?src-supplier=LKR; ComponentLink1Description: https://datasheet.octopart.com:443/ATMEGA16U2-AU-Microchip-datasheet-14435305.pdf?src-supplier=LKR; ComponentLink2URL: https://datasheet.octopart.com:443/ATMEGA16U2-AU-Microchip-datasheet-13413706.pdf?src-supplier=Farnell; ComponentLink2Description: https://datasheet.octopart.com:443/ATMEGA16U2-AU-Microchip-datasheet-13413706.pdf?src-supplier=Farnell; ComponentLink3URL: https://datasheet.octopart.com:443/ATMEGA16U2-AU-Microchip-datasheet-175858400.pdf?src-supplier=Microchip; ComponentLink3Description: https://datasheet.octopart.com:443/ATMEGA16U2-AU-Microchip-datasheet-175858400.pdf?src-supplier=Microchip; ComponentLink4URL: https://datasheet.octopart.com:443/ATMEGA16U2-AU-Atmel-datasheet-24967522.pdf?src-supplier=Newark; ComponentLink4Description: https://datasheet.octopart.com:443/ATMEGA16U2-AU-Atmel-datasheet-24967522.pdf?src-supplier=Newark; ComponentLink5URL: https://datasheet.octopart.com:443/ATMEGA16U2-AU-Atmel-datasheet-10031542.pdf?src-supplier=_legacy+Avnet; ComponentLink5Description: https://datasheet.octopart.com:443/ATMEGA16U2-AU-Atmel-datasheet-10031542.pdf?src-supplier=_legacy+Avnet; ComponentLink6URL: https://datasheet.octopart.com:443/ATMEGA16U2-AU-Atmel-datasheet-8702439.pdf?src-supplier=_legacy+Avnet; ComponentLink6Description: https://datasheet.octopart.com:443/ATMEGA16U2-AU-Atmel-datasheet-8702439.pdf?src-supplier=_legacy+Avnet; ComponentLink7URL: https://datasheet.octopart.com:443/ATMEGA16U2-AU-Atmel-datasheet-8367484.pdf?src-supplier=_legacy+Avnet; ComponentLink7Description: https://datasheet.octopart.com:443/ATMEGA16U2-AU-Atmel-datasheet-8367484.pdf?src-supplier=_legacy+Avnet; ComponentLink8URL: http://sigma.octopart.com:80/188450247/materials_sheet/Microchip-ATMEGA16U2-AU.pdf?src-supplier=Compliance+Statements; ComponentLink8Description: http://sigma.octopart.com:80/188450247/materials_sheet/Microchip-ATMEGA16U2-AU.pdf?src-supplier=Compliance+Statements; ComponentLink9URL: http://sigma.octopart.com:80/conflict_mineral_statement/Microchip-company-68.pdf?src-supplier=Compliance+Statements; ComponentLink9Description: http://sigma.octopart.com:80/conflict_mineral_statement/Microchip-company-68.pdf?src-supplier=Compliance+Statements; ComponentLink10URL: http://sigma.octopart.com:80/conflict_mineral_statement/Microchip-company-69.pdf?src-supplier=Compliance+Statements; ComponentLink10Description: http://sigma.octopart.com:80/conflict_mineral_statement/Microchip-company-69.pdf?src-supplier=Compliance+Statements; ComponentLink11URL: http://sigma.octopart.com:80/reach_statement/Microchip-company-70.pdf?src-supplier=Compliance+Statements; ComponentLink11Description: http://sigma.octopart.com:80/reach_statement/Microchip-company-70.pdf?src-supplier=Compliance+Statements; ComponentLink12URL: http://sigma.octopart.com:80/rohs_statement/Microchip-company-71.pdf?src-supplier=Compliance+Statements; ComponentLink12Description: http://sigma.octopart.com:80/rohs_statement/Microchip-company-71.pdf?src-supplier=Compliance+Statements; ComponentLink13URL: http://sigma.octopart.com:80/rohs_statement/Atmel-company-4.pdf?src-supplier=Compliance+Statements; ComponentLink13Description: http://sigma.octopart.com:80/rohs_statement/Atmel-company-4.pdf?src-supplier=Compliance+Statements; ComponentLink14URL: http://sigma.octopart.com:80/rohs_statement/Atmel-company-5.pdf?src-supplier=Compliance+Statements; ComponentLink14Description: http://sigma.octopart.com:80/rohs_statement/Atmel-company-5.pdf?src-supplier=Compliance+Statements; ComponentLink15URL: http://sigma.octopart.com:80/reach_statement/Atmel-company-6.pdf?src-supplier=Compliance+Statements; ComponentLink15Description: http://sigma.octopart.com:80/reach_statement/Atmel-company-6.pdf?src-supplier=Compliance+Statements
U2 U5-U7 U10 = SN74AHC1G09DBVR: 1-ch, 2-input 2-V to 5.5-V high-speed (9 ns) AND gate with open-drain outputs 5-SOT-23 -55 to 125; Manufacturer: Texas Instruments; Manufacturer Lifecycle Status: ACTIVE; Low Level Output Current: 8mA; Max Junction Temperature (Tj): 150°C; Max Supply Voltage: 5.5V; Min Supply Voltage: 2V; Nominal Supply Current: 1µA; Number of Bits: 1; Number of Inputs: 2; Output Current: 25mA; Propagation Delay: 4.6ns; Supplier: DigiKey; Supplier Part Number: 296-29202-1-ND; Manufacturer Part Number: SN74AHC1G09DBVR; RoHS: Compliant; Category: Logic Gates; Stock: 30418; Pricing: 1=0.12, 10=0.082, 25=0.0716, 100=0.0602, 250=0.05484, 500=0.05162, 1000=0.04896 (USD); Ambient Temperature Range High: 125°C; Case/Package: SOT-23; Contact Plating: Tin; Height: 1.45mm; Lead Free: Lead Free; Length: 2.9mm; Lifecycle Status: Production; Logic Function: AND; Max Operating Temperature: 125°C; Min Operating Temperature: -55°C; Mounting Technology: Surface Mount; Number of Channels: 1; Number of Circuits: 1; Number of Elements: 1; Number of Gates: 1; Number of Outputs: 1; Pins: 5; Output Voltage: 5.5V; Quiescent Current: 1µA; Radiation Hardening: No; REACH SVHC: No; Schedule B: 8542390000, 8542390000|8542390000|8542390000|8542390000|8542390000; Thickness: 1.2mm; Width: 1.6mm; ComponentLink1URL: https://sigma.octopart.com:443/177332311/technical_drawing/Texas-Instruments-SN74AHC1G09DBVR.pdf?src-supplier=Texas+Instruments; ComponentLink1Description: https://sigma.octopart.com:443/177332311/technical_drawing/Texas-Instruments-SN74AHC1G09DBVR.pdf?src-supplier=Texas+Instruments; ComponentLink2URL: https://octopart.com:443/opatz8j6/c1?t=CA0xI29egBiCU_6rQfhKNaGvddRY5SJasOuVjrBk3gM0bslEAm9nD3TWkjk2Lct6BLDH9t2AJbqNKQVEG8_riOyA-rPWz5SwJ1ethL-aYpF6XU7HYZLV9o7PHEiNElmEFA3QXmkggwHnZdJL8qGEj-9eSnY1A6-CERkVOd5rsCK9_mlNvaYfyg9pOmwCvYdOCNajjCzTULk-Xp-HaxXGnSMhEqjtvcvmqHoMBxwa7I-kkDwufM3-I67pzB7j8Ju6Xv4Yxe8r8UJ7yvhKWrnRkXkprKylITJLPll-5EYsOdPovoy79yFT8TGJVdxcac-mG0R9nk-3Zp6PQubrDntY0OxfYStQD2W3CZ5HOBch2dGCEuANEQJBYKVVq-1kuYuuz_Vo7YBNtlI&src-supplier=Texas+Instruments; ComponentLink2Description: https://octopart.com:443/opatz8j6/c1?t=CA0xI29egBiCU_6rQfhKNaGvddRY5SJasOuVjrBk3gM0bslEAm9nD3TWkjk2Lct6BLDH9t2AJbqNKQVEG8_riOyA-rPWz5SwJ1ethL-aYpF6XU7HYZLV9o7PHEiNElmEFA3QXmkggwHnZdJL8qGEj-9eSnY1A6-CERkVOd5rsCK9_mlNvaYfyg9pOmwCvYdOCNajjCzTULk-Xp-HaxXGnSMhEqjtvcvmqHoMBxwa7I-kkDwufM3-I67pzB7j8Ju6Xv4Yxe8r8UJ7yvhKWrnRkXkprKylITJLPll-5EYsOdPovoy79yFT8TGJVdxcac-mG0R9nk-3Zp6PQubrDntY0OxfYStQD2W3CZ5HOBch2dGCEuANEQJBYKVVq-1kuYuuz_Vo7YBNtlI&src-supplier=Texas+Instruments; ComponentLink3URL: https://datasheet.octopart.com:443/SN74AHC1G09DBVR-Texas-Instruments-datasheet-37726925.pdf?src-supplier=Texas+Instruments; ComponentLink3Description: https://datasheet.octopart.com:443/SN74AHC1G09DBVR-Texas-Instruments-datasheet-37726925.pdf?src-supplier=Texas+Instruments; ComponentLink4URL: https://sigma.octopart.com:443/175570406/technical_drawing/Texas-Instruments-SN74AHC1G09DBVR.pdf?src-supplier=Texas+Instruments; ComponentLink4Description: https://sigma.octopart.com:443/175570406/technical_drawing/Texas-Instruments-SN74AHC1G09DBVR.pdf?src-supplier=Texas+Instruments; ComponentLink5URL: https://sigma.octopart.com:443/169406034/technical_drawing/Texas-Instruments-SN74AHC1G09DBVR.pdf?src-supplier=Texas+Instruments; ComponentLink5Description: https://sigma.octopart.com:443/169406034/technical_drawing/Texas-Instruments-SN74AHC1G09DBVR.pdf?src-supplier=Texas+Instruments; ComponentLink6URL: https://sigma.octopart.com:443/155939316/technical_drawing/Texas-Instruments-SN74AHC1G09DBVR.pdf?src-supplier=Texas+Instruments; ComponentLink6Description: https://sigma.octopart.com:443/155939316/technical_drawing/Texas-Instruments-SN74AHC1G09DBVR.pdf?src-supplier=Texas+Instruments; ComponentLink7URL: https://sigma.octopart.com:443/102331370/technical_drawing/Texas-Instruments-SN74AHC1G09DBVR.pdf?src-supplier=Texas+Instruments; ComponentLink7Description: https://sigma.octopart.com:443/102331370/technical_drawing/Texas-Instruments-SN74AHC1G09DBVR.pdf?src-supplier=Texas+Instruments; ComponentLink8URL: https://sigma.octopart.com:443/49249325/technical_drawing/Texas-Instruments-SN74AHC1G09DBVR.pdf?src-supplier=Texas+Instruments; ComponentLink8Description: https://sigma.octopart.com:443/49249325/technical_drawing/Texas-Instruments-SN74AHC1G09DBVR.pdf?src-supplier=Texas+Instruments; ComponentLink9URL: https://datasheet.octopart.com:443/SN74AHC1G09DBVR-Texas-Instruments-datasheet-21221312.pdf?src-supplier=Upverter; ComponentLink9Description: https://datasheet.octopart.com:443/SN74AHC1G09DBVR-Texas-Instruments-datasheet-21221312.pdf?src-supplier=Upverter; ComponentLink10URL: https://datasheet.octopart.com:443/SN74AHC1G09DBVR-Texas-Instruments-datasheet-62088831.pdf?src-supplier=Newark; ComponentLink10Description: https://datasheet.octopart.com:443/SN74AHC1G09DBVR-Texas-Instruments-datasheet-62088831.pdf?src-supplier=Newark; ComponentLink11URL: https://datasheet.octopart.com:443/SN74AHC1G09DBVR-Texas-Instruments-datasheet-33010737.pdf?src-supplier=Newark; ComponentLink11Description: https://datasheet.octopart.com:443/SN74AHC1G09DBVR-Texas-Instruments-datasheet-33010737.pdf?src-supplier=Newark; ComponentLink12URL: https://datasheet.octopart.com:443/SN74AHC1G09DBVR-Texas-Instruments-datasheet-159115775.pdf?src-supplier=SHENGYU+ELECTRONICS; ComponentLink12Description: https://datasheet.octopart.com:443/SN74AHC1G09DBVR-Texas-Instruments-datasheet-159115775.pdf?src-supplier=SHENGYU+ELECTRONICS; ComponentLink13URL: https://datasheet.octopart.com:443/SN74AHC1G09DBVR-Texas-Instruments-datasheet-165804331.pdf?src-supplier=LCSC; ComponentLink13Description: https://datasheet.octopart.com:443/SN74AHC1G09DBVR-Texas-Instruments-datasheet-165804331.pdf?src-supplier=LCSC; ComponentLink14URL: https://datasheet.octopart.com:443/SN74AHC1G09DBVR-Texas-Instruments-datasheet-140571641.pdf?src-supplier=Arrow.cn; ComponentLink14Description: https://datasheet.octopart.com:443/SN74AHC1G09DBVR-Texas-Instruments-datasheet-140571641.pdf?src-supplier=Arrow.cn; ComponentLink15URL: https://datasheet.octopart.com:443/SN74AHC1G09DBVR-Texas-Instruments-datasheet-11780427.pdf?src-supplier=Arrow+Electronics; ComponentLink15Description: https://datasheet.octopart.com:443/SN74AHC1G09DBVR-Texas-Instruments-datasheet-11780427.pdf?src-supplier=Arrow+Electronics; ComponentLink16URL: http://sigma.octopart.com:80/conflict_mineral_statement/Texas-Instruments-company-63.pdf?src-supplier=Compliance+Statements; ComponentLink16Description: http://sigma.octopart.com:80/conflict_mineral_statement/Texas-Instruments-company-63.pdf?src-supplier=Compliance+Statements; ComponentLink17URL: http://sigma.octopart.com:80/reach_statement/Texas-Instruments-company-64.pdf?src-supplier=Compliance+Statements; ComponentLink17Description: http://sigma.octopart.com:80/reach_statement/Texas-Instruments-company-64.pdf?src-supplier=Compliance+Statements
U3 = TL1963A-33DCQR: LDO Regulator Pos 3.3V 1.5A 6-Pin(5+Tab) SOT-223 T/R; Manufacturer: Texas Instruments; Manufacturer Lifecycle Status: ACTIVE; Accuracy: 3%; Dropout Voltage: 340mV; Input Bias Current: 1mA; Max Supply Voltage: 20V; Min Current Limit: 1.6A; Min Input Voltage: 2.1V; Number of Outputs: 1; Output Type: Fixed; Polarity: Positive; Supplier: DigiKey; Supplier Part Number: 296-24534-1-ND; Manufacturer Part Number: TL1963A-33DCQR; RoHS: Compliant; Category: LDO Voltage Regulators; Stock: 7773; Pricing: 1=3.4, 10=2.559, 25=2.348, 100=2.1156, 250=2.00476, 500=1.93796, 1000=1.88298 (USD); Case/Package: SOT-223; Contact Plating: Gold; Height: 0m; Lead Free: Lead Free; Length: 6.5mm; Lifecycle Status: Production; Max Operating Temperature: 125°C; Max Output current: 1.5A; Max Output Voltage: 3.3V; Min Operating Temperature: -40°C; Min Output Voltage: 3.3V; Pins: 6; Number of Regulators: 1; Output Current: 1.5A; Output Voltage: 3.3V; Packaging: Tape and Reel; Quiescent Current: 1mA; Radiation Hardening: No; Schedule B: 8542390000, 8542390000|8542390000|8542390000|8542390000|8542390000; Thickness: 1.6mm; Width: 3.5mm; ComponentLink1URL: https://sigma.octopart.com:443/157894086/technical_drawing/Texas-Instruments-TL1963A-33DCQR.pdf?src-supplier=Texas+Instruments; ComponentLink1Description: https://sigma.octopart.com:443/157894086/technical_drawing/Texas-Instruments-TL1963A-33DCQR.pdf?src-supplier=Texas+Instruments; ComponentLink2URL: https://octopart.com:443/opatz8j6/c1?t=9mD5RQULXI1ak7xeTysiqjMNtmnZ6f-5FrTvB7_r4DbHBLnBFyEEUAB7oQRFYnYBddczv3zb-szTrB03ftlZv2FcwSVbX1IUuCPz-F24EiocuVTyjXQaBrNwp0XWuc7ycFLAG_MKvZUBNRr1Kujjht5i4PaggjT-7bJY3-jj4DZpnnQIv7ySfpA6BMsphC1XW0_WwwgTXSKtZ1S6jwFHj7xvtBGZxuzfucLIfP5AIvSdtd4umaO4rR7NVOA6J3EyqGEsttc9TpCdgXmdws0TU8wj62VhhBxgIxrcHRMQN5GOh_xn18L9hc08DAt5ZWFL704F4Wh3Om-1wD4IH2LlknCXxwJwnYLHjLAF550iU_Eu_AsOvtCZCrOkfmPYMENTiRLgx3I&src-supplier=Texas+Instruments; ComponentLink2Description: https://octopart.com:443/opatz8j6/c1?t=9mD5RQULXI1ak7xeTysiqjMNtmnZ6f-5FrTvB7_r4DbHBLnBFyEEUAB7oQRFYnYBddczv3zb-szTrB03ftlZv2FcwSVbX1IUuCPz-F24EiocuVTyjXQaBrNwp0XWuc7ycFLAG_MKvZUBNRr1Kujjht5i4PaggjT-7bJY3-jj4DZpnnQIv7ySfpA6BMsphC1XW0_WwwgTXSKtZ1S6jwFHj7xvtBGZxuzfucLIfP5AIvSdtd4umaO4rR7NVOA6J3EyqGEsttc9TpCdgXmdws0TU8wj62VhhBxgIxrcHRMQN5GOh_xn18L9hc08DAt5ZWFL704F4Wh3Om-1wD4IH2LlknCXxwJwnYLHjLAF550iU_Eu_AsOvtCZCrOkfmPYMENTiRLgx3I&src-supplier=Texas+Instruments; ComponentLink3URL: https://datasheet.octopart.com:443/TL1963A-33DCQR-Texas-Instruments-datasheet-36835243.pdf?src-supplier=Texas+Instruments; ComponentLink3Description: https://datasheet.octopart.com:443/TL1963A-33DCQR-Texas-Instruments-datasheet-36835243.pdf?src-supplier=Texas+Instruments; ComponentLink4URL: https://sigma.octopart.com:443/49257225/technical_drawing/Texas-Instruments-TL1963A-33DCQR.pdf?src-supplier=Texas+Instruments; ComponentLink4Description: https://sigma.octopart.com:443/49257225/technical_drawing/Texas-Instruments-TL1963A-33DCQR.pdf?src-supplier=Texas+Instruments; ComponentLink5URL: https://datasheet.octopart.com:443/TL1963A-33DCQR-Texas-Instruments-datasheet-10255270.pdf?src-supplier=Texas+Instruments; ComponentLink5Description: https://datasheet.octopart.com:443/TL1963A-33DCQR-Texas-Instruments-datasheet-10255270.pdf?src-supplier=Texas+Instruments; ComponentLink6URL: https://datasheet.octopart.com:443/TL1963A-33DCQR-Texas-Instruments-datasheet-159117591.pdf?src-supplier=Augswan; ComponentLink6Description: https://datasheet.octopart.com:443/TL1963A-33DCQR-Texas-Instruments-datasheet-159117591.pdf?src-supplier=Augswan; ComponentLink7URL: http://sigma.octopart.com:80/conflict_mineral_statement/Texas-Instruments-company-63.pdf?src-supplier=Compliance+Statements; ComponentLink7Description: http://sigma.octopart.com:80/conflict_mineral_statement/Texas-Instruments-company-63.pdf?src-supplier=Compliance+Statements; ComponentLink8URL: http://sigma.octopart.com:80/reach_statement/Texas-Instruments-company-64.pdf?src-supplier=Compliance+Statements; ComponentLink8Description: http://sigma.octopart.com:80/reach_statement/Texas-Instruments-company-64.pdf?src-supplier=Compliance+Statements